# EAGLE design arduino-dev-stick (EAGLE 5.07)
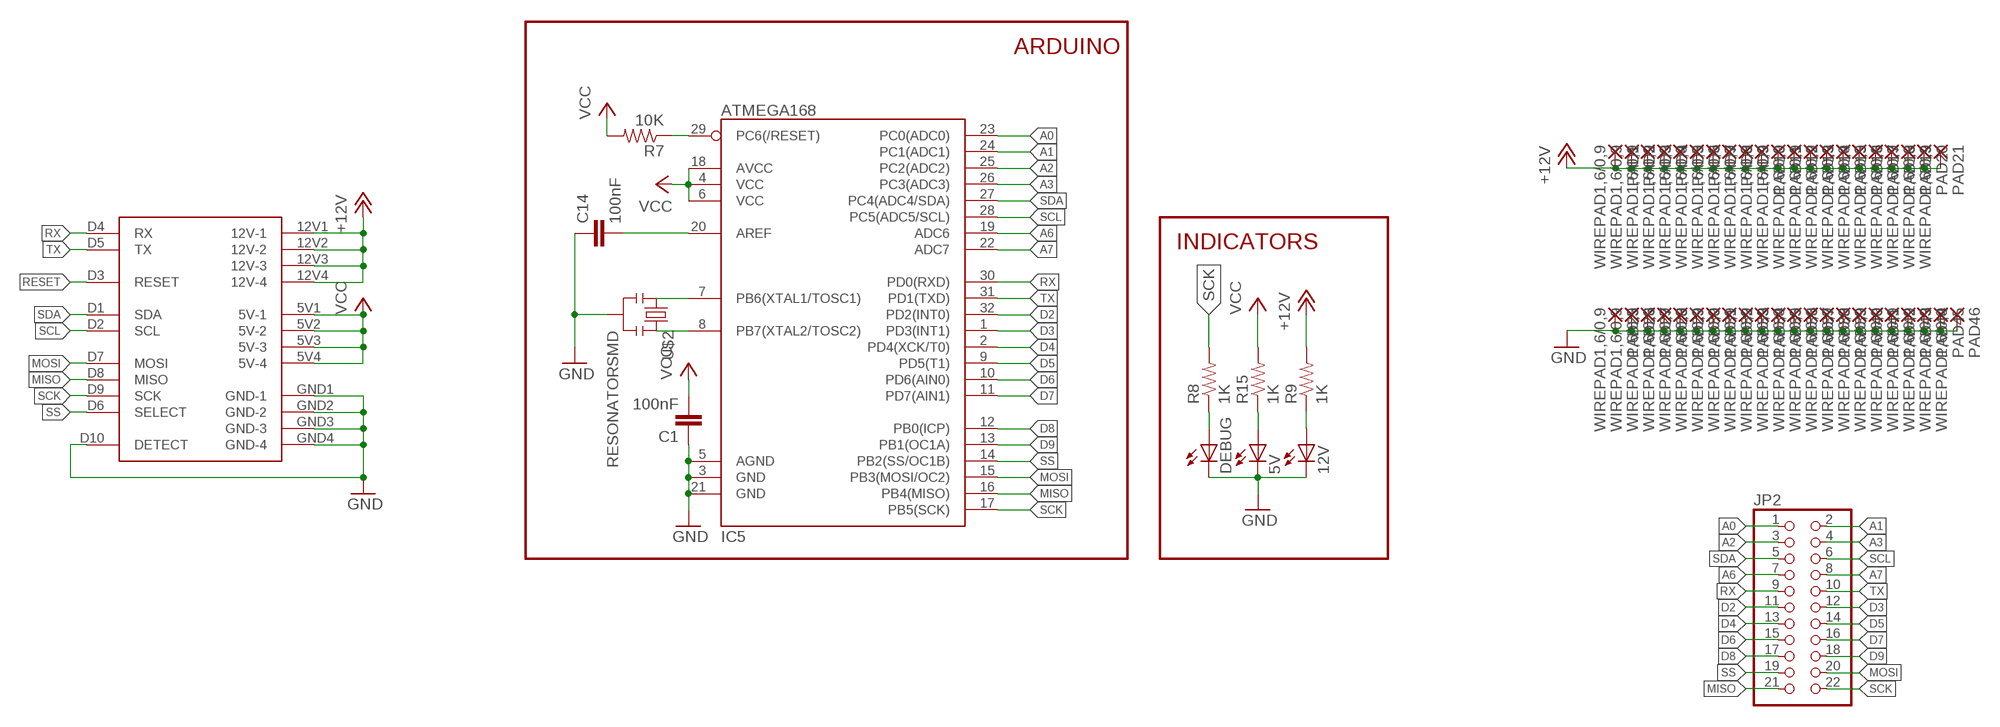
[diagram p0: schematic, sheet 1, part 1 of 2]
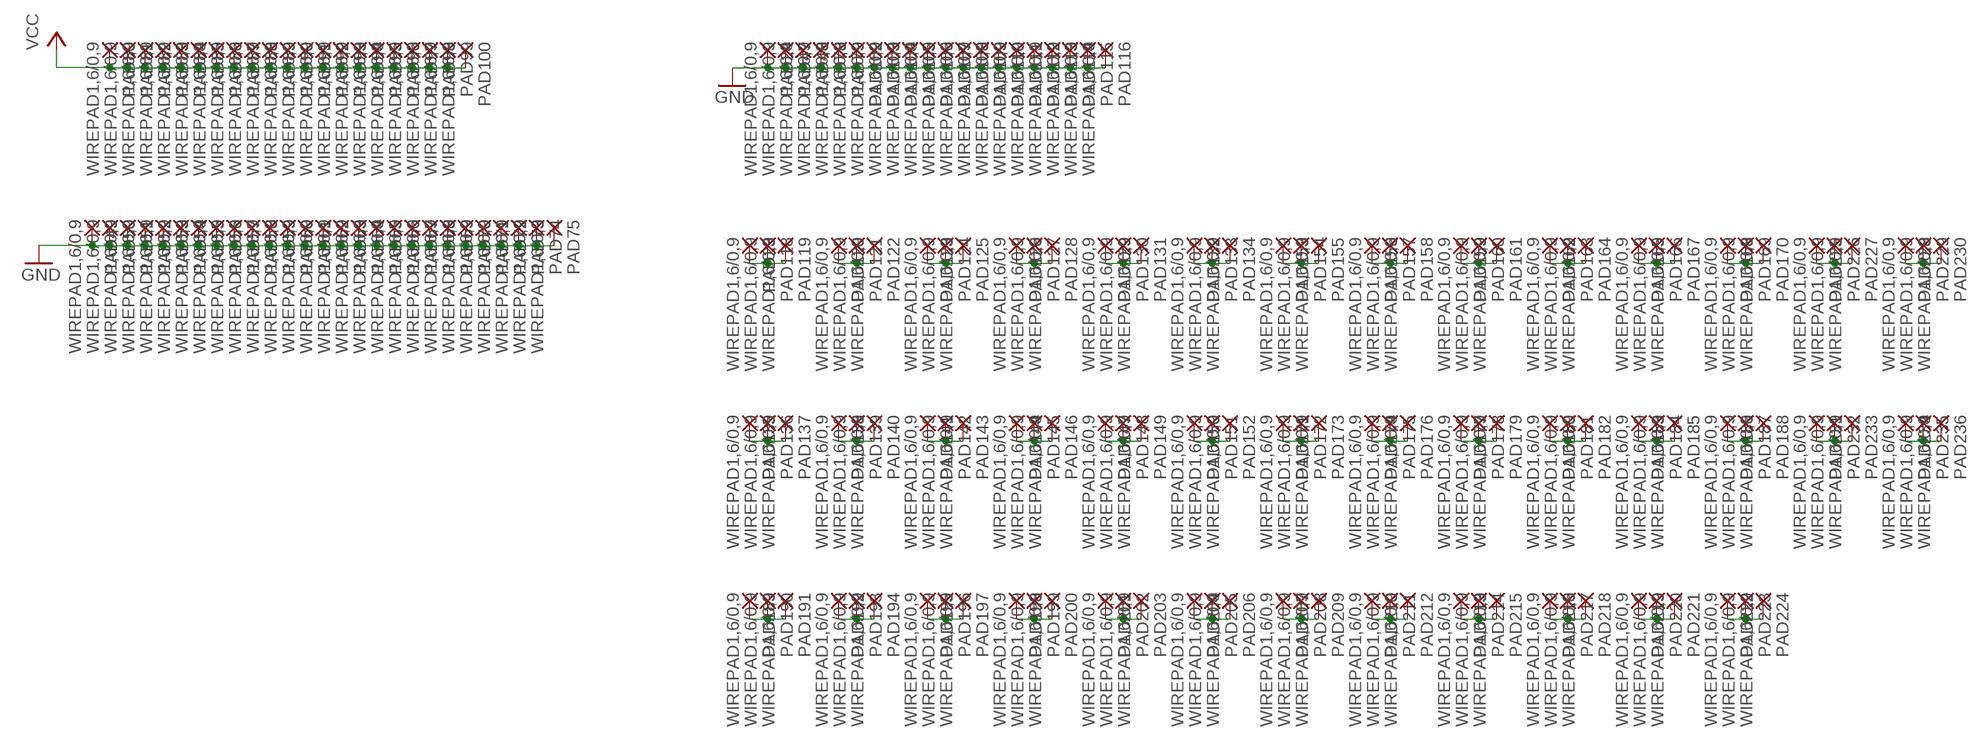
[diagram p1: schematic, sheet 1, part 2 of 2]

## Parts
5V  LED0805  [LED-0805]
12V  LED0805  [LED-0805]
C1  100nF  CAP0805  [0805]
C14  100nF  CAP0805  [0805]
DEBUG  LED0805  [LED-0805]
IC5  ATMEGA168  [TQFP32-08]
JP2  PINHD-2X11  [2X11]
PAD1  WIREPAD1,6/0,9  [1,6/0,9]
PAD2  WIREPAD1,6/0,9  [1,6/0,9]
PAD3  WIREPAD1,6/0,9  [1,6/0,9]
PAD4  WIREPAD1,6/0,9  [1,6/0,9]
PAD5  WIREPAD1,6/0,9  [1,6/0,9]
PAD6  WIREPAD1,6/0,9  [1,6/0,9]
PAD7  WIREPAD1,6/0,9  [1,6/0,9]
PAD8  WIREPAD1,6/0,9  [1,6/0,9]
PAD9  WIREPAD1,6/0,9  [1,6/0,9]
PAD10  WIREPAD1,6/0,9  [1,6/0,9]
PAD11  WIREPAD1,6/0,9  [1,6/0,9]
PAD12  WIREPAD1,6/0,9  [1,6/0,9]
PAD13  WIREPAD1,6/0,9  [1,6/0,9]
PAD14  WIREPAD1,6/0,9  [1,6/0,9]
PAD15  WIREPAD1,6/0,9  [1,6/0,9]
PAD16  WIREPAD1,6/0,9  [1,6/0,9]
PAD17  WIREPAD1,6/0,9  [1,6/0,9]
PAD18  WIREPAD1,6/0,9  [1,6/0,9]
PAD19  WIREPAD1,6/0,9  [1,6/0,9]
PAD20  WIREPAD1,6/0,9  [1,6/0,9]
PAD21  WIREPAD1,6/0,9  [1,6/0,9]
PAD23  WIREPAD1,6/0,9  [1,6/0,9]
PAD24  WIREPAD1,6/0,9  [1,6/0,9]
PAD25  WIREPAD1,6/0,9  [1,6/0,9]
PAD26  WIREPAD1,6/0,9  [1,6/0,9]
PAD27  WIREPAD1,6/0,9  [1,6/0,9]
PAD28  WIREPAD1,6/0,9  [1,6/0,9]
PAD29  WIREPAD1,6/0,9  [1,6/0,9]
PAD30  WIREPAD1,6/0,9  [1,6/0,9]
PAD31  WIREPAD1,6/0,9  [1,6/0,9]
PAD32  WIREPAD1,6/0,9  [1,6/0,9]
PAD33  WIREPAD1,6/0,9  [1,6/0,9]
PAD34  WIREPAD1,6/0,9  [1,6/0,9]
PAD35  WIREPAD1,6/0,9  [1,6/0,9]
PAD36  WIREPAD1,6/0,9  [1,6/0,9]
PAD37  WIREPAD1,6/0,9  [1,6/0,9]
PAD38  WIREPAD1,6/0,9  [1,6/0,9]
PAD39  WIREPAD1,6/0,9  [1,6/0,9]
PAD40  WIREPAD1,6/0,9  [1,6/0,9]
PAD41  WIREPAD1,6/0,9  [1,6/0,9]
PAD42  WIREPAD1,6/0,9  [1,6/0,9]
PAD43  WIREPAD1,6/0,9  [1,6/0,9]
PAD44  WIREPAD1,6/0,9  [1,6/0,9]
PAD45  WIREPAD1,6/0,9  [1,6/0,9]
PAD46  WIREPAD1,6/0,9  [1,6/0,9]
PAD47  WIREPAD1,6/0,9  [1,6/0,9]
PAD48  WIREPAD1,6/0,9  [1,6/0,9]
PAD49  WIREPAD1,6/0,9  [1,6/0,9]
PAD50  WIREPAD1,6/0,9  [1,6/0,9]
PAD51  WIREPAD1,6/0,9  [1,6/0,9]
PAD52  WIREPAD1,6/0,9  [1,6/0,9]
PAD53  WIREPAD1,6/0,9  [1,6/0,9]
PAD54  WIREPAD1,6/0,9  [1,6/0,9]
PAD55  WIREPAD1,6/0,9  [1,6/0,9]
PAD56  WIREPAD1,6/0,9  [1,6/0,9]
PAD57  WIREPAD1,6/0,9  [1,6/0,9]
PAD58  WIREPAD1,6/0,9  [1,6/0,9]
PAD59  WIREPAD1,6/0,9  [1,6/0,9]
PAD60  WIREPAD1,6/0,9  [1,6/0,9]
PAD61  WIREPAD1,6/0,9  [1,6/0,9]
PAD62  WIREPAD1,6/0,9  [1,6/0,9]
PAD63  WIREPAD1,6/0,9  [1,6/0,9]
PAD64  WIREPAD1,6/0,9  [1,6/0,9]
PAD65  WIREPAD1,6/0,9  [1,6/0,9]
PAD66  WIREPAD1,6/0,9  [1,6/0,9]
PAD67  WIREPAD1,6/0,9  [1,6/0,9]
PAD68  WIREPAD1,6/0,9  [1,6/0,9]
PAD69  WIREPAD1,6/0,9  [1,6/0,9]
PAD70  WIREPAD1,6/0,9  [1,6/0,9]
PAD71  WIREPAD1,6/0,9  [1,6/0,9]
PAD72  WIREPAD1,6/0,9  [1,6/0,9]
PAD73  WIREPAD1,6/0,9  [1,6/0,9]
PAD74  WIREPAD1,6/0,9  [1,6/0,9]
PAD75  WIREPAD1,6/0,9  [1,6/0,9]
PAD78  WIREPAD1,6/0,9  [1,6/0,9]
PAD79  WIREPAD1,6/0,9  [1,6/0,9]
PAD80  WIREPAD1,6/0,9  [1,6/0,9]
PAD81  WIREPAD1,6/0,9  [1,6/0,9]
PAD82  WIREPAD1,6/0,9  [1,6/0,9]
PAD83  WIREPAD1,6/0,9  [1,6/0,9]
PAD84  WIREPAD1,6/0,9  [1,6/0,9]
PAD85  WIREPAD1,6/0,9  [1,6/0,9]
PAD86  WIREPAD1,6/0,9  [1,6/0,9]
PAD87  WIREPAD1,6/0,9  [1,6/0,9]
PAD88  WIREPAD1,6/0,9  [1,6/0,9]
PAD89  WIREPAD1,6/0,9  [1,6/0,9]
PAD90  WIREPAD1,6/0,9  [1,6/0,9]
PAD91  WIREPAD1,6/0,9  [1,6/0,9]
PAD92  WIREPAD1,6/0,9  [1,6/0,9]
PAD93  WIREPAD1,6/0,9  [1,6/0,9]
PAD94  WIREPAD1,6/0,9  [1,6/0,9]
PAD95  WIREPAD1,6/0,9  [1,6/0,9]
PAD96  WIREPAD1,6/0,9  [1,6/0,9]
PAD97  WIREPAD1,6/0,9  [1,6/0,9]
PAD98  WIREPAD1,6/0,9  [1,6/0,9]
PAD99  WIREPAD1,6/0,9  [1,6/0,9]
PAD100  WIREPAD1,6/0,9  [1,6/0,9]
PAD102  WIREPAD1,6/0,9  [1,6/0,9]
PAD103  WIREPAD1,6/0,9  [1,6/0,9]
PAD104  WIREPAD1,6/0,9  [1,6/0,9]
PAD105  WIREPAD1,6/0,9  [1,6/0,9]
PAD106  WIREPAD1,6/0,9  [1,6/0,9]
PAD107  WIREPAD1,6/0,9  [1,6/0,9]
PAD108  WIREPAD1,6/0,9  [1,6/0,9]
PAD109  WIREPAD1,6/0,9  [1,6/0,9]
PAD110  WIREPAD1,6/0,9  [1,6/0,9]
PAD111  WIREPAD1,6/0,9  [1,6/0,9]
PAD112  WIREPAD1,6/0,9  [1,6/0,9]
PAD113  WIREPAD1,6/0,9  [1,6/0,9]
PAD114  WIREPAD1,6/0,9  [1,6/0,9]
PAD115  WIREPAD1,6/0,9  [1,6/0,9]
PAD116  WIREPAD1,6/0,9  [1,6/0,9]
PAD118  WIREPAD1,6/0,9  [1,6/0,9]
PAD119  WIREPAD1,6/0,9  [1,6/0,9]
PAD120  WIREPAD1,6/0,9  [1,6/0,9]
PAD121  WIREPAD1,6/0,9  [1,6/0,9]
PAD122  WIREPAD1,6/0,9  [1,6/0,9]
PAD123  WIREPAD1,6/0,9  [1,6/0,9]
PAD124  WIREPAD1,6/0,9  [1,6/0,9]
PAD125  WIREPAD1,6/0,9  [1,6/0,9]
PAD126  WIREPAD1,6/0,9  [1,6/0,9]
PAD127  WIREPAD1,6/0,9  [1,6/0,9]
PAD128  WIREPAD1,6/0,9  [1,6/0,9]
PAD129  WIREPAD1,6/0,9  [1,6/0,9]
PAD130  WIREPAD1,6/0,9  [1,6/0,9]
PAD131  WIREPAD1,6/0,9  [1,6/0,9]
PAD132  WIREPAD1,6/0,9  [1,6/0,9]
PAD133  WIREPAD1,6/0,9  [1,6/0,9]
PAD134  WIREPAD1,6/0,9  [1,6/0,9]
PAD135  WIREPAD1,6/0,9  [1,6/0,9]
PAD136  WIREPAD1,6/0,9  [1,6/0,9]
PAD137  WIREPAD1,6/0,9  [1,6/0,9]
PAD138  WIREPAD1,6/0,9  [1,6/0,9]
PAD139  WIREPAD1,6/0,9  [1,6/0,9]
PAD140  WIREPAD1,6/0,9  [1,6/0,9]
PAD141  WIREPAD1,6/0,9  [1,6/0,9]
PAD142  WIREPAD1,6/0,9  [1,6/0,9]
PAD143  WIREPAD1,6/0,9  [1,6/0,9]
PAD144  WIREPAD1,6/0,9  [1,6/0,9]
PAD145  WIREPAD1,6/0,9  [1,6/0,9]
PAD146  WIREPAD1,6/0,9  [1,6/0,9]
PAD147  WIREPAD1,6/0,9  [1,6/0,9]
PAD148  WIREPAD1,6/0,9  [1,6/0,9]
PAD149  WIREPAD1,6/0,9  [1,6/0,9]
PAD150  WIREPAD1,6/0,9  [1,6/0,9]
PAD151  WIREPAD1,6/0,9  [1,6/0,9]
PAD152  WIREPAD1,6/0,9  [1,6/0,9]
PAD153  WIREPAD1,6/0,9  [1,6/0,9]
PAD154  WIREPAD1,6/0,9  [1,6/0,9]
PAD155  WIREPAD1,6/0,9  [1,6/0,9]
PAD156  WIREPAD1,6/0,9  [1,6/0,9]
PAD157  WIREPAD1,6/0,9  [1,6/0,9]
PAD158  WIREPAD1,6/0,9  [1,6/0,9]
PAD159  WIREPAD1,6/0,9  [1,6/0,9]
PAD160  WIREPAD1,6/0,9  [1,6/0,9]
PAD161  WIREPAD1,6/0,9  [1,6/0,9]
PAD162  WIREPAD1,6/0,9  [1,6/0,9]
PAD163  WIREPAD1,6/0,9  [1,6/0,9]
PAD164  WIREPAD1,6/0,9  [1,6/0,9]
PAD165  WIREPAD1,6/0,9  [1,6/0,9]
PAD166  WIREPAD1,6/0,9  [1,6/0,9]
PAD167  WIREPAD1,6/0,9  [1,6/0,9]
PAD168  WIREPAD1,6/0,9  [1,6/0,9]
PAD169  WIREPAD1,6/0,9  [1,6/0,9]
PAD170  WIREPAD1,6/0,9  [1,6/0,9]
PAD171  WIREPAD1,6/0,9  [1,6/0,9]
PAD172  WIREPAD1,6/0,9  [1,6/0,9]
PAD173  WIREPAD1,6/0,9  [1,6/0,9]
PAD174  WIREPAD1,6/0,9  [1,6/0,9]
PAD175  WIREPAD1,6/0,9  [1,6/0,9]
PAD176  WIREPAD1,6/0,9  [1,6/0,9]
PAD177  WIREPAD1,6/0,9  [1,6/0,9]
PAD178  WIREPAD1,6/0,9  [1,6/0,9]
PAD179  WIREPAD1,6/0,9  [1,6/0,9]
PAD180  WIREPAD1,6/0,9  [1,6/0,9]
PAD181  WIREPAD1,6/0,9  [1,6/0,9]
PAD182  WIREPAD1,6/0,9  [1,6/0,9]
PAD183  WIREPAD1,6/0,9  [1,6/0,9]
PAD184  WIREPAD1,6/0,9  [1,6/0,9]
PAD185  WIREPAD1,6/0,9  [1,6/0,9]
PAD186  WIREPAD1,6/0,9  [1,6/0,9]
PAD187  WIREPAD1,6/0,9  [1,6/0,9]
PAD188  WIREPAD1,6/0,9  [1,6/0,9]
PAD189  WIREPAD1,6/0,9  [1,6/0,9]
PAD190  WIREPAD1,6/0,9  [1,6/0,9]
PAD191  WIREPAD1,6/0,9  [1,6/0,9]
PAD192  WIREPAD1,6/0,9  [1,6/0,9]
PAD193  WIREPAD1,6/0,9  [1,6/0,9]
PAD194  WIREPAD1,6/0,9  [1,6/0,9]
PAD195  WIREPAD1,6/0,9  [1,6/0,9]
PAD196  WIREPAD1,6/0,9  [1,6/0,9]
PAD197  WIREPAD1,6/0,9  [1,6/0,9]
PAD198  WIREPAD1,6/0,9  [1,6/0,9]
PAD199  WIREPAD1,6/0,9  [1,6/0,9]
PAD200  WIREPAD1,6/0,9  [1,6/0,9]
PAD201  WIREPAD1,6/0,9  [1,6/0,9]
PAD202  WIREPAD1,6/0,9  [1,6/0,9]
PAD203  WIREPAD1,6/0,9  [1,6/0,9]
PAD204  WIREPAD1,6/0,9  [1,6/0,9]
PAD205  WIREPAD1,6/0,9  [1,6/0,9]
PAD206  WIREPAD1,6/0,9  [1,6/0,9]
PAD207  WIREPAD1,6/0,9  [1,6/0,9]
PAD208  WIREPAD1,6/0,9  [1,6/0,9]
PAD209  WIREPAD1,6/0,9  [1,6/0,9]
PAD210  WIREPAD1,6/0,9  [1,6/0,9]
PAD211  WIREPAD1,6/0,9  [1,6/0,9]
PAD212  WIREPAD1,6/0,9  [1,6/0,9]
PAD213  WIREPAD1,6/0,9  [1,6/0,9]
PAD214  WIREPAD1,6/0,9  [1,6/0,9]
PAD215  WIREPAD1,6/0,9  [1,6/0,9]
PAD216  WIREPAD1,6/0,9  [1,6/0,9]
PAD217  WIREPAD1,6/0,9  [1,6/0,9]
PAD218  WIREPAD1,6/0,9  [1,6/0,9]
PAD219  WIREPAD1,6/0,9  [1,6/0,9]
PAD220  WIREPAD1,6/0,9  [1,6/0,9]
PAD221  WIREPAD1,6/0,9  [1,6/0,9]
PAD222  WIREPAD1,6/0,9  [1,6/0,9]
PAD223  WIREPAD1,6/0,9  [1,6/0,9]
PAD224  WIREPAD1,6/0,9  [1,6/0,9]
PAD225  WIREPAD1,6/0,9  [1,6/0,9]
PAD226  WIREPAD1,6/0,9  [1,6/0,9]
PAD227  WIREPAD1,6/0,9  [1,6/0,9]
PAD228  WIREPAD1,6/0,9  [1,6/0,9]
PAD229  WIREPAD1,6/0,9  [1,6/0,9]
PAD230  WIREPAD1,6/0,9  [1,6/0,9]
PAD231  WIREPAD1,6/0,9  [1,6/0,9]
PAD232  WIREPAD1,6/0,9  [1,6/0,9]
PAD233  WIREPAD1,6/0,9  [1,6/0,9]
PAD234  WIREPAD1,6/0,9  [1,6/0,9]
PAD235  WIREPAD1,6/0,9  [1,6/0,9]
PAD236  WIREPAD1,6/0,9  [1,6/0,9]
R7  10K  RESISTOR  [0805]
R8  1K  RESISTOR  [0805]
R9  1K  RESISTOR  [0805]
R15  1K  RESISTOR  [0805]
U$1  MAKERSTICK  [MAKEITSTICK]
U$2  RESONATORSMD  [RESONATOR-SMD]

## Nets
+12V [power]: PAD1.1(P) PAD2.1(P) PAD3.1(P) PAD4.1(P) PAD5.1(P) PAD6.1(P) PAD7.1(P) PAD8.1(P) PAD9.1(P) PAD10.1(P) PAD11.1(P) PAD12.1(P) PAD13.1(P) PAD14.1(P) PAD15.1(P) PAD16.1(P) PAD17.1(P) PAD18.1(P) PAD19.1(P) PAD20.1(P) PAD21.1(P) R9.2 U$1.12V1(12V-1) U$1.12V2(12V-2) U$1.12V3(12V-3) U$1.12V4(12V-4)
A0: IC5.23(PC0(ADC0)) JP2.1
A1: IC5.24(PC1(ADC1)) JP2.2
A2: IC5.25(PC2(ADC2)) JP2.3
A3: IC5.26(PC3(ADC3)) JP2.4
A6: IC5.19(ADC6) JP2.7
A7: IC5.22(ADC7) JP2.8
D2: IC5.32(PD2(INT0)) JP2.11
D3: IC5.1(PD3(INT1)) JP2.12
D4: IC5.2(PD4(XCK/T0)) JP2.13
D5: IC5.9(PD5(T1)) JP2.14
D6: IC5.10(PD6(AIN0)) JP2.15
D7: IC5.11(PD7(AIN1)) JP2.16
D8: IC5.12(PB0(ICP)) JP2.17
D9: IC5.13(PB1(OC1A)) JP2.18
GND [power]: 5V.C 12V.C C1.1 C14.1 DEBUG.C IC5.3(GND) IC5.5(AGND) IC5.21(GND) PAD24.1(P) PAD25.1(P) PAD26.1(P) PAD27.1(P) PAD28.1(P) PAD29.1(P) PAD30.1(P) PAD31.1(P) PAD32.1(P) PAD33.1(P) PAD34.1(P) PAD35.1(P) PAD36.1(P) PAD37.1(P) PAD38.1(P) PAD39.1(P) PAD40.1(P) PAD41.1(P) PAD42.1(P) PAD43.1(P) PAD44.1(P) PAD45.1(P) PAD46.1(P) PAD47.1(P) PAD48.1(P) PAD49.1(P) PAD50.1(P) PAD51.1(P) PAD52.1(P) PAD53.1(P) PAD54.1(P) PAD55.1(P) PAD56.1(P) PAD57.1(P) PAD58.1(P) PAD59.1(P) PAD60.1(P) PAD61.1(P) PAD62.1(P) PAD63.1(P) PAD64.1(P) PAD65.1(P) PAD66.1(P) PAD67.1(P) PAD68.1(P) PAD69.1(P) PAD70.1(P) PAD71.1(P) PAD72.1(P) PAD73.1(P) PAD74.1(P) PAD75.1(P) PAD78.1(P) PAD79.1(P) PAD102.1(P) PAD103.1(P) PAD104.1(P) PAD105.1(P) PAD106.1(P) PAD107.1(P) PAD108.1(P) PAD109.1(P) PAD110.1(P) PAD111.1(P) PAD112.1(P) PAD113.1(P) PAD114.1(P) PAD115.1(P) PAD116.1(P) U$1.D10(DETECT) U$1.GND1(GND-1) U$1.GND2(GND-2) U$1.GND3(GND-3) U$1.GND4(GND-4) U$2.2
MISO: IC5.16(PB4(MISO)) JP2.21 U$1.D8(MISO)
MOSI: IC5.15(PB3(MOSI/OC2)) JP2.20 U$1.D7(MOSI)
N$1: PAD23.1(P) PAD118.1(P) PAD119.1(P)
N$3: PAD120.1(P) PAD121.1(P) PAD122.1(P)
N$4: PAD123.1(P) PAD124.1(P) PAD125.1(P)
N$5: PAD126.1(P) PAD127.1(P) PAD128.1(P)
N$6: PAD129.1(P) PAD130.1(P) PAD131.1(P)
N$7: PAD132.1(P) PAD133.1(P) PAD134.1(P)
N$8: DEBUG.A R8.1
N$9: PAD135.1(P) PAD136.1(P) PAD137.1(P)
N$10: PAD138.1(P) PAD139.1(P) PAD140.1(P)
N$11: PAD141.1(P) PAD142.1(P) PAD143.1(P)
N$12: PAD144.1(P) PAD145.1(P) PAD146.1(P)
N$13: PAD147.1(P) PAD148.1(P) PAD149.1(P)
N$14: PAD150.1(P) PAD151.1(P) PAD152.1(P)
N$15: PAD153.1(P) PAD154.1(P) PAD155.1(P)
N$16: PAD156.1(P) PAD157.1(P) PAD158.1(P)
N$17: PAD159.1(P) PAD160.1(P) PAD161.1(P)
N$18: PAD162.1(P) PAD163.1(P) PAD164.1(P)
N$19: PAD165.1(P) PAD166.1(P) PAD167.1(P)
N$20: C14.2 IC5.20(AREF)
N$21: PAD168.1(P) PAD169.1(P) PAD170.1(P)
N$22: PAD171.1(P) PAD172.1(P) PAD173.1(P)
N$23: PAD174.1(P) PAD175.1(P) PAD176.1(P)
N$24: PAD177.1(P) PAD178.1(P) PAD179.1(P)
N$25: 5V.A R15.1
N$26: 12V.A R9.1
N$27: PAD180.1(P) PAD181.1(P) PAD182.1(P)
N$28: PAD183.1(P) PAD184.1(P) PAD185.1(P)
N$29: PAD186.1(P) PAD187.1(P) PAD188.1(P)
N$30: PAD189.1(P) PAD190.1(P) PAD191.1(P)
N$31: PAD192.1(P) PAD193.1(P) PAD194.1(P)
N$32: PAD195.1(P) PAD196.1(P) PAD197.1(P)
N$33: PAD198.1(P) PAD199.1(P) PAD200.1(P)
N$34: PAD201.1(P) PAD202.1(P) PAD203.1(P)
N$35: PAD204.1(P) PAD205.1(P) PAD206.1(P)
N$36: PAD207.1(P) PAD208.1(P) PAD209.1(P)
N$37: PAD210.1(P) PAD211.1(P) PAD212.1(P)
N$38: PAD213.1(P) PAD214.1(P) PAD215.1(P)
N$39: PAD216.1(P) PAD217.1(P) PAD218.1(P)
N$40: PAD219.1(P) PAD220.1(P) PAD221.1(P)
N$41: PAD222.1(P) PAD223.1(P) PAD224.1(P)
N$42: PAD225.1(P) PAD226.1(P) PAD227.1(P)
N$43: PAD228.1(P) PAD229.1(P) PAD230.1(P)
N$44: PAD231.1(P) PAD232.1(P) PAD233.1(P)
N$45: PAD234.1(P) PAD235.1(P) PAD236.1(P)
N$48: IC5.8(PB7(XTAL2/TOSC2)) U$2.3
N$49: IC5.7(PB6(XTAL1/TOSC1)) U$2.1
RESET: IC5.29(PC6(/RESET)) R7.1 U$1.D3(RESET)
RX: IC5.30(PD0(RXD)) JP2.9 U$1.D4(RX)
SCK: IC5.17(PB5(SCK)) JP2.22 R8.2 U$1.D9(SCK)
SCL: IC5.28(PC5(ADC5/SCL)) JP2.6 U$1.D2(SCL)
SDA: IC5.27(PC4(ADC4/SDA)) JP2.5 U$1.D1(SDA)
SS: IC5.14(PB2(SS/OC1B)) JP2.19 U$1.D6(SELECT)
TX: IC5.31(PD1(TXD)) JP2.10 U$1.D5(TX)
VCC: C1.2 IC5.4(VCC) IC5.6(VCC) IC5.18(AVCC) PAD80.1(P) PAD81.1(P) PAD82.1(P) PAD83.1(P) PAD84.1(P) PAD85.1(P) PAD86.1(P) PAD87.1(P) PAD88.1(P) PAD89.1(P) PAD90.1(P) PAD91.1(P) PAD92.1(P) PAD93.1(P) PAD94.1(P) PAD95.1(P) PAD96.1(P) PAD97.1(P) PAD98.1(P) PAD99.1(P) PAD100.1(P) R7.2 R15.2 U$1.5V1(5V-1) U$1.5V2(5V-2) U$1.5V3(5V-3) U$1.5V4(5V-4)

## Notes on the sheet
- ARDUINO
- INDICATORS

## Library data of the parts
5V 12V DEBUG = SparkFun:LED: LEDs Standard schematic elements and footprints for 5mm, 3mm, 1206, and 0603 sized LEDs. 5mm - Spark Fun Electronics SKU : COM-00529 (and others)
C1 C14 = SparkFun:CAP: Capacitor Standard 0603 ceramic capacitor, and 0.1" leaded capacitor.
IC5 = SparkFun:ATMEGA168
JP2 = pinhead:PINHD-2X11: PIN HEADER
PAD1-PAD21 PAD23-PAD75 PAD78-PAD100 PAD102-PAD116 PAD118-PAD236 = wirepad:WIREPAD: Wire PAD connect wire on PCB
R7-R9 R15 = SparkFun:RESISTOR: Resistor Basic schematic elements and footprints for 0603, 1206, and PTH 1/10th watt (small) resistors.
U$1 = crap:MAKERSTICK
U$2 = SparkFun:RESONATOR: Resonator Small SMD resonator. This is the itty bitty 10/20MHz resonators with built in caps. CSTCE10M0G55 and CSTCE20M0V53. Footprint has been reviewed closely but hasn't been tested yet.

## Net classes
0 default: width 0.305 mm
1 power: width 1.016 mm
2 motors: width 0.762 mm

## Board
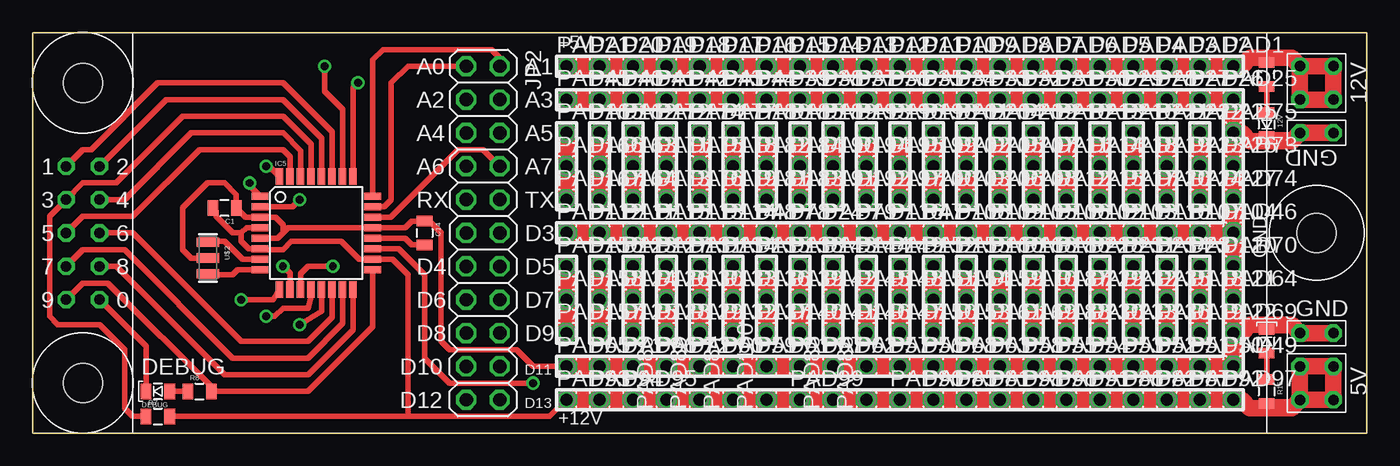
[diagram p2: board, top side]
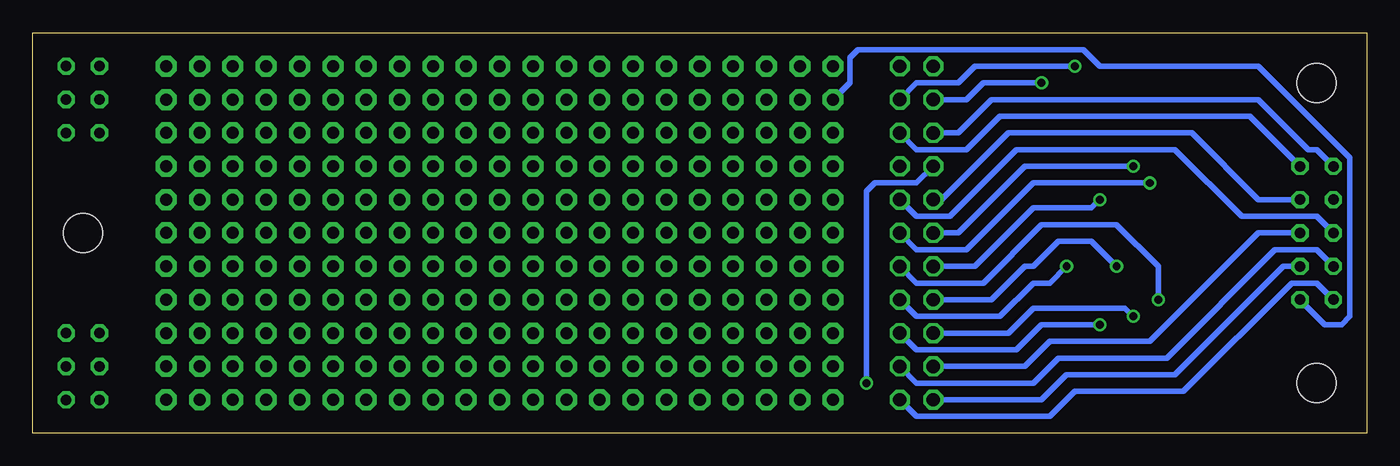
[diagram p3: board, bottom side, seen from below]

Size 101.6 x 30.48 mm. Coordinates in mm from the lower left corner, seen from the top.
Outline: 0,0 101.6,0 101.6,30.48 0,30.48 0,0
Copper layers (1*16): Top 0.035mm / dielectric 1.5mm / Bottom 0.035mm
Design rules "default": minimum track width 10mil, minimum drill 24mil, track to track 8mil, track to pad 8mil, pad to pad 8mil, via to via 8mil, smd to smd 8mil, copper to edge 40mil, drill to drill 8mil, minimum pad ring 10mil, minimum via ring 8mil, stop-mask expansion 4mil, vias tented up to drill 0mil, thermal gap 10mil

### Footprints (pad centres in the part's own frame; a part is rotated, then mirrored left to right if it is on the bottom)
LED-0805 = smd 1.2 x 0.8: A 0,-0.9; C 0,0.9
0805 = smd 0.8 x 1.2: 1 -0.9,0; 2 0.9,0
TQFP32-08 = smd 1.27 x 0.559: 1 -4.293,2.8; 2 -4.293,2; 3 -4.293,1.2; 4 -4.293,0.4; 5 -4.293,-0.4; 6 -4.293,-1.2; 7 -4.293,-2; 8 -4.293,-2.8; 17 4.293,-2.8; 18 4.293,-2; 19 4.293,-1.2; 20 4.293,-0.4; 21 4.293,0.4; 22 4.293,1.2; 23 4.293,2; 24 4.293,2.8 | smd 0.559 x 1.27: 9 -2.8,-4.293; 10 -2,-4.293; 11 -1.2,-4.293; 12 -0.4,-4.293; 13 0.4,-4.293; 14 1.2,-4.293; 15 2,-4.293; 16 2.8,-4.293; 25 2.8,4.293; 26 2,4.293; 27 1.2,4.293; 28 0.4,4.293; 29 -0.4,4.293; 30 -1.2,4.293; 31 -2,4.293; 32 -2.8,4.293
2X11 = drill 1.016 octagon: 1 -12.7,-1.27; 2 -12.7,1.27; 3 -10.16,-1.27; 4 -10.16,1.27; 5 -7.62,-1.27; 6 -7.62,1.27; 7 -5.08,-1.27; 8 -5.08,1.27; 9 -2.54,-1.27; 10 -2.54,1.27; 11 0,-1.27; 12 0,1.27; 13 2.54,-1.27; 14 2.54,1.27; 15 5.08,-1.27; 16 5.08,1.27; 17 7.62,-1.27; 18 7.62,1.27; 19 10.16,-1.27; 20 10.16,1.27; 21 12.7,-1.27; 22 12.7,1.27
1,6/0,9 = drill 0.914 pad 1.6 octagon: 1 0,0
MAKEITSTICK = drill 0.8 octagon: 5V1 96.52,5.08; 5V2 99.06,5.08; 5V3 96.52,2.54; 5V4 99.06,2.54; 12V1 96.52,27.94; 12V2 99.06,27.94; 12V3 96.52,25.4; 12V4 99.06,25.4; D1 2.54,20.32; D2 5.08,20.32; D3 2.54,17.78; D4 5.08,17.78; D5 2.54,15.24; D6 5.08,15.24; D7 2.54,12.7; D8 5.08,12.7; D9 2.54,10.16; D10 5.08,10.16; GND1 96.52,22.86; GND2 99.06,22.86; GND3 96.52,7.62; GND4 99.06,7.62 | hole 3: 3.81,26.67; 3.81,3.81; 97.79,15.24
RESONATOR-SMD = smd 0.7 x 1.7: 1 -1.2,0; 2 0,0; 3 1.2,0

### Placement (x,y rotation side)
5V  93.98,6.99 0 top
12V  93.98,23.5 180 top
C1  14.61,17.14 180 top
C14  29.84,15.24 270 top
DEBUG  9.53,3.17 90 top
IC5  21.59,15.24 0 top
JP2  34.29,15.24 270 top
PAD1  91.44,27.94 0 top
PAD2  88.9,27.94 0 top
PAD3  86.36,27.94 0 top
PAD4  83.82,27.94 0 top
PAD5  81.28,27.94 0 top
PAD6  78.74,27.94 0 top
PAD7  76.2,27.94 0 top
PAD8  73.66,27.94 0 top
PAD9  71.12,27.94 0 top
PAD10  68.58,27.94 0 top
PAD11  66.04,27.94 0 top
PAD12  63.5,27.94 0 top
PAD13  60.96,27.94 0 top
PAD14  58.42,27.94 0 top
PAD15  55.88,27.94 0 top
PAD16  53.34,27.94 0 top
PAD17  50.8,27.94 0 top
PAD18  48.26,27.94 0 top
PAD19  45.72,27.94 0 top
PAD20  43.18,27.94 0 top
PAD21  40.64,27.94 0 top
PAD23  86.36,12.7 0 top
PAD24  58.42,15.24 0 top
PAD25  91.44,25.4 0 top
PAD26  88.9,25.4 0 top
PAD27  86.36,25.4 0 top
PAD28  83.82,25.4 0 top
PAD29  81.28,25.4 0 top
PAD30  78.74,25.4 0 top
PAD31  76.2,25.4 0 top
PAD32  73.66,25.4 0 top
PAD33  71.12,25.4 0 top
PAD34  68.58,25.4 0 top
PAD35  66.04,25.4 0 top
PAD36  63.5,25.4 0 top
PAD37  60.96,25.4 0 top
PAD38  58.42,25.4 0 top
PAD39  55.88,25.4 0 top
PAD40  43.18,25.4 0 top
PAD41  45.72,25.4 0 top
PAD42  48.26,25.4 0 top
PAD43  50.8,25.4 0 top
PAD44  53.34,25.4 0 top
PAD45  40.64,25.4 0 top
PAD46  91.44,15.24 0 top
PAD47  66.04,15.24 0 top
PAD48  53.34,15.24 0 top
PAD49  91.44,5.08 0 top
PAD50  88.9,5.08 0 top
PAD51  86.36,5.08 0 top
PAD52  83.82,5.08 0 top
PAD53  81.28,5.08 0 top
PAD54  78.74,5.08 0 top
PAD55  76.2,5.08 0 top
PAD56  66.04,5.08 0 top
PAD57  63.5,5.08 0 top
PAD58  73.66,5.08 0 top
PAD59  53.34,5.08 0 top
PAD60  50.8,5.08 0 top
PAD61  55.88,5.08 0 top
PAD62  60.96,5.08 0 top
PAD63  71.12,5.08 0 top
PAD64  91.44,10.16 0 top
PAD65  40.64,5.08 0 top
PAD66  45.72,5.08 0 top
PAD67  58.42,5.08 0 top
PAD68  68.58,5.08 0 top
PAD69  91.44,7.62 0 top
PAD70  91.44,12.7 0 top
PAD71  43.18,5.08 0 top
PAD72  48.26,5.08 0 top
PAD73  91.44,20.32 0 top
PAD74  91.44,17.78 0 top
PAD75  91.44,22.86 0 top
PAD78  55.88,15.24 0 top
PAD79  60.96,15.24 0 top
PAD80  48.26,2.54 90 top
PAD81  71.12,2.54 0 top
PAD82  83.82,2.54 0 top
PAD83  60.96,2.54 90 top
PAD84  53.34,2.54 90 top
PAD85  68.58,2.54 0 top
PAD86  81.28,2.54 0 top
PAD87  86.36,2.54 0 top
PAD88  63.5,2.54 90 top
PAD89  50.8,2.54 90 top
PAD90  66.04,2.54 0 top
PAD91  78.74,2.54 0 top
PAD92  88.9,2.54 0 top
PAD93  40.64,2.54 0 top
PAD94  43.18,2.54 0 top
PAD95  45.72,2.54 0 top
PAD96  76.2,2.54 0 top
PAD97  91.44,2.54 0 top
PAD98  73.66,2.54 0 top
PAD99  58.42,2.54 0 top
PAD100  55.88,2.54 90 top
PAD102  78.74,15.24 0 top
PAD103  81.28,15.24 0 top
PAD104  88.9,15.24 0 top
PAD105  73.66,15.24 0 top
PAD106  76.2,15.24 0 top
PAD107  86.36,15.24 0 top
PAD108  68.58,15.24 0 top
PAD109  71.12,15.24 0 top
PAD110  83.82,15.24 0 top
PAD111  43.18,15.24 0 top
PAD112  40.64,15.24 0 top
PAD113  48.26,15.24 0 top
PAD114  50.8,15.24 0 top
PAD115  45.72,15.24 0 top
PAD116  63.5,15.24 0 top
PAD118  86.36,10.16 0 top
PAD119  86.36,7.62 0 top
PAD120  88.9,12.7 0 top
PAD121  88.9,10.16 0 top
PAD122  88.9,7.62 0 top
PAD123  43.18,12.7 0 top
PAD124  43.18,10.16 0 top
PAD125  43.18,7.62 0 top
PAD126  45.72,10.16 0 top
PAD127  45.72,12.7 0 top
PAD128  45.72,7.62 0 top
PAD129  48.26,7.62 0 top
PAD130  48.26,10.16 0 top
PAD131  48.26,12.7 0 top
PAD132  50.8,7.62 0 top
PAD133  50.8,10.16 0 top
PAD134  50.8,12.7 0 top
PAD135  53.34,12.7 0 top
PAD136  53.34,10.16 0 top
PAD137  53.34,7.62 0 top
PAD138  55.88,12.7 0 top
PAD139  55.88,10.16 0 top
PAD140  55.88,7.62 0 top
PAD141  58.42,7.62 0 top
PAD142  58.42,10.16 0 top
PAD143  58.42,12.7 0 top
PAD144  60.96,12.7 0 top
PAD145  60.96,10.16 0 top
PAD146  60.96,7.62 0 top
PAD147  63.5,7.62 0 top
PAD148  63.5,10.16 0 top
PAD149  63.5,12.7 0 top
PAD150  66.04,7.62 0 top
PAD151  66.04,10.16 0 top
PAD152  66.04,12.7 0 top
PAD153  68.58,7.62 0 top
PAD154  68.58,10.16 0 top
PAD155  68.58,12.7 0 top
PAD156  40.64,12.7 0 top
PAD157  40.64,7.62 0 top
PAD158  40.64,10.16 0 top
PAD159  71.12,10.16 0 top
PAD160  71.12,12.7 0 top
PAD161  71.12,7.62 0 top
PAD162  43.18,22.86 0 top
PAD163  43.18,20.32 0 top
PAD164  43.18,17.78 0 top
PAD165  40.64,22.86 0 top
PAD166  40.64,20.32 0 top
PAD167  40.64,17.78 0 top
PAD168  73.66,12.7 0 top
PAD169  73.66,7.62 0 top
PAD170  73.66,10.16 0 top
PAD171  45.72,20.32 0 top
PAD172  45.72,22.86 0 top
PAD173  45.72,17.78 0 top
PAD174  48.26,22.86 0 top
PAD175  48.26,20.32 0 top
PAD176  48.26,17.78 0 top
PAD177  50.8,22.86 0 top
PAD178  50.8,20.32 0 top
PAD179  50.8,17.78 0 top
PAD180  53.34,22.86 0 top
PAD181  53.34,17.78 0 top
PAD182  53.34,20.32 0 top
PAD183  55.88,17.78 0 top
PAD184  55.88,20.32 0 top
PAD185  55.88,22.86 0 top
PAD186  76.2,12.7 0 top
PAD187  76.2,10.16 0 top
PAD188  76.2,7.62 0 top
PAD189  58.42,22.86 0 top
PAD190  58.42,20.32 0 top
PAD191  58.42,17.78 0 top
PAD192  60.96,17.78 0 top
PAD193  60.96,22.86 0 top
PAD194  60.96,20.32 0 top
PAD195  63.5,20.32 0 top
PAD196  63.5,22.86 0 top
PAD197  63.5,17.78 0 top
PAD198  66.04,22.86 0 top
PAD199  66.04,20.32 0 top
PAD200  66.04,17.78 0 top
PAD201  68.58,22.86 0 top
PAD202  68.58,20.32 0 top
PAD203  68.58,17.78 0 top
PAD204  71.12,22.86 0 top
PAD205  71.12,20.32 0 top
PAD206  71.12,17.78 0 top
PAD207  73.66,20.32 0 top
PAD208  73.66,17.78 0 top
PAD209  73.66,22.86 0 top
PAD210  76.2,22.86 0 top
PAD211  76.2,20.32 0 top
PAD212  76.2,17.78 0 top
PAD213  78.74,22.86 0 top
PAD214  78.74,20.32 0 top
PAD215  78.74,17.78 0 top
PAD216  81.28,22.86 0 top
PAD217  81.28,17.78 0 top
PAD218  81.28,20.32 0 top
PAD219  83.82,20.32 0 top
PAD220  83.82,17.78 0 top
PAD221  83.82,22.86 0 top
PAD222  86.36,22.86 0 top
PAD223  86.36,20.32 0 top
PAD224  86.36,17.78 0 top
PAD225  88.9,22.86 0 top
PAD226  88.9,20.32 0 top
PAD227  88.9,17.78 0 top
PAD228  78.74,12.7 0 top
PAD229  78.74,10.16 0 top
PAD230  78.74,7.62 0 top
PAD231  81.28,12.7 0 top
PAD232  81.28,10.16 0 top
PAD233  81.28,7.62 0 top
PAD234  83.82,12.7 0 top
PAD235  83.82,10.16 0 top
PAD236  83.82,7.62 0 top
R7  9.53,1.27 0 top
R8  12.7,3.17 0 top
R9  93.98,27.3 90 top
R15  93.98,3.17 270 top
U$1  0,0 0 top
U$2  13.34,13.34 270 top

### Tracks (layer width: path | path; a pad name or v marks a point on that pad's centre or on a via)
+12V
  Top 0.61: R9.2 93.72,28.2 93.34,28.57
  Top 1.27: PAD21.1 PAD20.1 PAD19.1 PAD18.1 PAD17.1 PAD16.1 PAD15.1 PAD14.1 PAD13.1 PAD12.1 PAD11.1 PAD10.1 PAD9.1 PAD8.1 PAD7.1 PAD6.1 PAD5.1 PAD4.1 PAD3.1 PAD2.1 PAD1.1 92.08,27.94 92.71,28.57 93.34,28.57 95.89,28.57 U$1.12V1 | U$1.12V1 U$1.12V3 U$1.12V4 U$1.12V2 U$1.12V1
A0
  Top 0.406: IC5.23 26.77,17.24 27.3,17.78 27.3,26.67 28.57,27.94 JP2.1
A1
  Top 0.406: IC5.24 25.88,28.42 26.67,29.21 34.92,29.21 35.56,28.57 JP2.2
A2  (via drill 0.6)
  Top 0.406: IC5.25 24.39,26.3 v24.77,26.67
  Bottom 0.406: v24.77,26.67 29.21,26.67 30.48,25.4 JP2.3
A3  (via drill 0.6)
  Top 0.406: IC5.26 23.59,24.67 22.23,26.04 v22.23,27.94
  Bottom 0.406: v22.23,27.94 29.84,27.94 31.11,26.67 34.29,26.67 JP2.4
A6  (via drill 0.6)
  Top 0.406: IC5.19 27.87,14.04 29.84,12.06 29.84,5.71 31.75,3.81 v38.1,3.81
  Bottom 0.406: v38.1,3.81 38.1,18.41 37.47,19.05 34.29,19.05 JP2.7
A7
  Top 0.406: IC5.22 27.23,16.44 32.38,21.59 34.29,21.59 JP2.8
D2  (via drill 0.6)
  Top 0.406: v17.78,20.32 18,20.32 IC5.32
  Bottom 0.406: JP2.11 31.11,15.24 26.04,20.32 v17.78,20.32
D3  (via drill 0.6)
  Top 0.406: v16.51,19.05 16.51,18.83 IC5.1
  Bottom 0.406: JP2.12 34.29,13.97 30.48,13.97 25.4,19.05 v16.51,19.05
D4  (via drill 0.6)
  Top 0.406: IC5.2 19.78,17.24 v20.32,17.78
  Bottom 0.406: v20.32,17.78 20.95,17.14 25.4,17.14 29.84,12.7 JP2.13
D5  (via drill 0.6)
  Top 0.406: v15.88,10.16 18.31,10.16 IC5.9
  Bottom 0.406: JP2.14 34.29,11.43 29.21,11.43 24.77,15.88 19.05,15.88 15.88,12.7 v15.88,10.16
D6  (via drill 0.6)
  Top 0.406: IC5.10 19.59,12.16 v19.05,12.7
  Bottom 0.406: JP2.15 28.57,10.16 26.04,12.7 25.4,12.7 23.5,14.61 20.95,14.61 v19.05,12.7
D7  (via drill 0.6)
  Top 0.406: IC5.11 20.39,12.13 20.95,12.7 v22.86,12.7
  Bottom 0.406: JP2.16 34.29,8.89 27.94,8.89 25.4,11.43 24.13,11.43 v22.86,12.7
D8  (via drill 0.6)
  Top 0.406: IC5.12 21.19,10.39 20.95,9.53 19.05,9.53 18.41,8.89 v17.78,8.89
  Bottom 0.406: JP2.17 27.3,7.62 25.4,9.53 18.41,9.53 v17.78,8.89
D9  (via drill 0.6)
  Top 0.406: IC5.13 21.99,9.29 v20.32,8.26
  Bottom 0.406: v20.32,8.26 24.77,8.26 26.67,6.35 34.29,6.35 JP2.18
GND
  Top 0.406: 19.05,15.24 19.05,15.88 18.48,16.44 IC5.3 16.21,16.44 C1.1 15.51,18.15 14.61,19.05 13.34,19.05 11.43,17.14 11.43,13.97 12.06,13.34 U$2.2 | IC5.5 18.65,14.84 19.05,15.24 | 19.05,15.24 19.45,15.64 IC5.21 28.34,15.64 28.84,16.14 C14.1 30.21,16.14 31.11,15.24 31.11,6.99 31.75,6.35 36.83,6.35 38.1,5.08 PAD65.1 | DEBUG.C 8.62,6.62 U$1.D10
  Top 0.61: 12V.C 96.25,22.59 U$1.GND1 | 5V.C 96.25,7.88 U$1.GND3
  Top 1.27: PAD45.1 PAD40.1 PAD41.1 PAD42.1 PAD43.1 PAD44.1 PAD39.1 PAD38.1 PAD37.1 PAD36.1 PAD35.1 PAD34.1 PAD33.1 PAD32.1 PAD31.1 PAD30.1 PAD29.1 PAD28.1 PAD27.1 PAD26.1 PAD25.1 PAD75.1 | PAD75.1 PAD73.1 PAD74.1 PAD46.1 | PAD69.1 PAD64.1 PAD70.1 PAD46.1 | PAD69.1 PAD49.1 PAD50.1 PAD51.1 PAD52.1 PAD53.1 PAD54.1 PAD55.1 PAD58.1 PAD63.1 PAD68.1 PAD56.1 PAD57.1 PAD62.1 PAD67.1 PAD61.1 PAD59.1 PAD60.1 PAD72.1 PAD66.1 PAD71.1 PAD65.1 | U$1.GND4 U$1.GND3 95.89,8.26 92.71,8.26 92.08,7.62 PAD69.1 | U$1.GND2 U$1.GND1 95.89,22.23 92.71,22.23 92.08,22.86 PAD75.1 | PAD112.1 PAD111.1 PAD115.1 PAD113.1 PAD114.1 PAD48.1 PAD78.1 PAD24.1 PAD79.1 PAD116.1 PAD47.1 PAD108.1 PAD109.1 PAD105.1 PAD106.1 PAD102.1 PAD103.1 PAD110.1 PAD107.1 PAD104.1 PAD46.1
  Bottom 0.406: U$1.D10 3.17,8.26 1.91,8.26 1.27,8.89 1.27,20.95 8.26,27.94 20.32,27.94 21.59,29.21 38.73,29.21 39.37,28.57 39.37,26.67 PAD45.1
MISO
  Top 0.406: IC5.16 24.39,7.88 20.95,4.45 14.61,4.45 6.35,12.7 U$1.D8
  Bottom 0.406: U$1.D8 6.35,12.7 14.61,4.45 22.86,4.45 24.77,2.54 JP2.21
MOSI
  Top 0.406: IC5.15 23.59,8.35 20.95,5.71 15.24,5.71 6.99,13.97 3.81,13.97 U$1.D7
  Bottom 0.406: U$1.D7 3.81,13.97 6.99,13.97 15.24,5.71 23.5,5.71 25.4,3.81 34.29,3.81 JP2.20
N$1
  Top 1.27: PAD23.1 PAD118.1 PAD119.1
N$3
  Top 1.27: PAD120.1 PAD121.1 PAD122.1
N$4
  Top 1.27: PAD123.1 PAD124.1 PAD125.1
N$5
  Top 1.27: PAD127.1 PAD126.1 PAD128.1
N$6
  Top 1.27: PAD131.1 PAD130.1 PAD129.1
N$7
  Top 1.27: PAD134.1 PAD133.1 PAD132.1
N$8
  Top 0.406: DEBUG.A R8.1
N$9
  Top 1.27: PAD135.1 PAD136.1 PAD137.1
N$10
  Top 1.27: PAD138.1 PAD139.1 PAD140.1
N$11
  Top 1.27: PAD143.1 PAD142.1 PAD141.1
N$12
  Top 1.27: PAD144.1 PAD145.1 PAD146.1
N$13
  Top 1.27: PAD149.1 PAD148.1 PAD147.1
N$14
  Top 1.27: PAD152.1 PAD151.1 PAD150.1
N$15
  Top 1.27: PAD155.1 PAD154.1 PAD153.1
N$16
  Top 1.27: PAD156.1 PAD158.1 PAD157.1
N$17
  Top 1.27: PAD160.1 PAD159.1 PAD161.1
N$18
  Top 1.27: PAD162.1 PAD163.1 PAD164.1
N$19
  Top 1.27: PAD165.1 PAD166.1 PAD167.1
N$20
  Top 0.406: IC5.20 28.34,14.84 28.84,14.34 C14.2
N$21
  Top 1.27: PAD168.1 PAD170.1 PAD169.1
N$22
  Top 1.27: PAD172.1 PAD171.1 PAD173.1
N$23
  Top 1.27: PAD174.1 PAD175.1 PAD176.1
N$24
  Top 1.27: PAD177.1 PAD178.1 PAD179.1
N$25
  Top 0.406: R15.1 5V.A
N$26
  Top 0.406: 12V.A R9.1
N$27
  Top 1.27: PAD180.1 PAD182.1 PAD181.1
N$28
  Top 1.27: PAD185.1 PAD184.1 PAD183.1
N$29
  Top 1.27: PAD186.1 PAD187.1 PAD188.1
N$30
  Top 1.27: PAD189.1 PAD190.1 PAD191.1
N$31
  Top 1.27: PAD193.1 PAD194.1 PAD192.1
N$32
  Top 1.27: PAD196.1 PAD195.1 PAD197.1
N$33
  Top 1.27: PAD198.1 PAD199.1 PAD200.1
N$34
  Top 1.27: PAD201.1 PAD202.1 PAD203.1
N$35
  Top 1.27: PAD204.1 PAD205.1 PAD206.1
N$36
  Top 1.27: PAD209.1 PAD207.1 PAD208.1
N$37
  Top 1.27: PAD210.1 PAD211.1 PAD212.1
N$38
  Top 1.27: PAD213.1 PAD214.1 PAD215.1
N$39
  Top 1.27: PAD216.1 PAD218.1 PAD217.1
N$40
  Top 1.27: PAD221.1 PAD219.1 PAD220.1
N$41
  Top 1.27: PAD222.1 PAD223.1 PAD224.1
N$42
  Top 1.27: PAD225.1 PAD226.1 PAD227.1
N$43
  Top 1.27: PAD228.1 PAD229.1 PAD230.1
N$44
  Top 1.27: PAD231.1 PAD232.1 PAD233.1
N$45
  Top 1.27: PAD234.1 PAD235.1 PAD236.1
N$48
  Top 0.406: IC5.8 15.62,12.44 15.24,12.06 13.4,12.06 U$2.3
N$49
  Top 0.406: IC5.7 15.97,13.24 14.61,14.61 13.4,14.61 U$2.1
RESET
  Top 0.406: IC5.29 21.19,21.99 19.05,24.13 11.43,24.13 6.35,19.05 3.81,19.05 U$1.D3 1.27,16.51 1.27,8.89 1.91,8.26 5.08,8.26 6.99,6.35 6.99,1.91 7.62,1.27 R7.1
RX
  Top 0.406: IC5.30 20.39,21.52 19.05,22.86 12.06,22.86 6.99,17.78 U$1.D4
  Bottom 0.406: U$1.D4 8.26,17.78 13.34,22.86 27.3,22.86 32.38,17.78 JP2.9
SCK
  Top 0.406: IC5.17 25.88,8.1 20.95,3.17 13.97,3.17 | 13.97,3.17 5.71,11.43 3.81,11.43 U$1.D9 | 13.97,3.17 R8.2
  Bottom 0.406: U$1.D9 3.81,11.43 5.71,11.43 13.97,3.17 22.23,3.17 24.13,1.27 34.29,1.27 JP2.22
SCL
  Top 0.406: IC5.28 21.99,22.46 19.05,25.4 10.16,25.4 U$1.D2
  Bottom 0.406: JP2.6 34.29,21.59 30.48,21.59 27.94,24.13 8.89,24.13 U$1.D2
SDA
  Top 0.406: IC5.27 22.79,22.93 19.05,26.67 9.53,26.67 4.45,21.59 3.81,21.59 U$1.D1
  Bottom 0.406: JP2.5 31.11,22.86 28.57,25.4 8.26,25.4 4.45,21.59 3.81,21.59 U$1.D1
SS
  Top 0.406: IC5.14 22.79,8.82 20.95,6.99 15.88,6.99 7.62,15.24 U$1.D6
  Bottom 0.406: U$1.D6 8.26,15.24 16.51,6.99 24.13,6.99 26.04,5.08 JP2.19
TX
  Top 0.406: IC5.31 19.59,21.05 19.05,21.59 12.7,21.59 7.62,16.51 3.81,16.51 U$1.D5
  Bottom 0.406: U$1.D5 3.81,16.51 9.53,16.51 14.61,21.59 26.67,21.59 31.75,16.51 34.29,16.51 JP2.10
VCC
  Top 0.406: 15.88,15.24 15.88,14.61 16.44,14.04 IC5.6 17.37,13.97 19.05,13.97 19.68,14.61 23.5,14.61 24.86,13.24 IC5.18 27.4,13.24 28.57,12.06 28.57,1.27 | IC5.4 16.27,15.64 15.88,15.24 | PAD93.1 39.37,1.27 28.57,1.27 | R7.2 28.57,1.27 | 15.88,15.24 15.24,15.24 13.97,16.51 13.97,16.88 C1.2
  Top 0.61: R15.2 96.25,2.27 U$1.5V3
  Top 1.27: PAD93.1 PAD94.1 PAD95.1 PAD80.1 PAD89.1 PAD84.1 PAD100.1 PAD99.1 PAD83.1 PAD88.1 PAD90.1 PAD85.1 PAD81.1 PAD98.1 PAD96.1 PAD91.1 PAD86.1 PAD82.1 PAD87.1 PAD92.1 PAD97.1 92.08,2.54 92.71,1.91 95.89,1.91 U$1.5V3 | U$1.5V3 U$1.5V4 U$1.5V2 U$1.5V1 U$1.5V3

### Text on the board
tPlace: +5V | A0 | A1 | A2 | A3 | A4 | A5 | A6 | A7 | RX | TX | D3 | GND | D4 | D5 | D6 | D7 | D8 | D9 | DEBUG | D10 | D11 | D12 | D13 | +12V